# Altium schematic sheet FPGA_SDRAM.SchDoc
size A3; DocumentNumber: 18; SheetNumber: 18; SheetTotal: 30
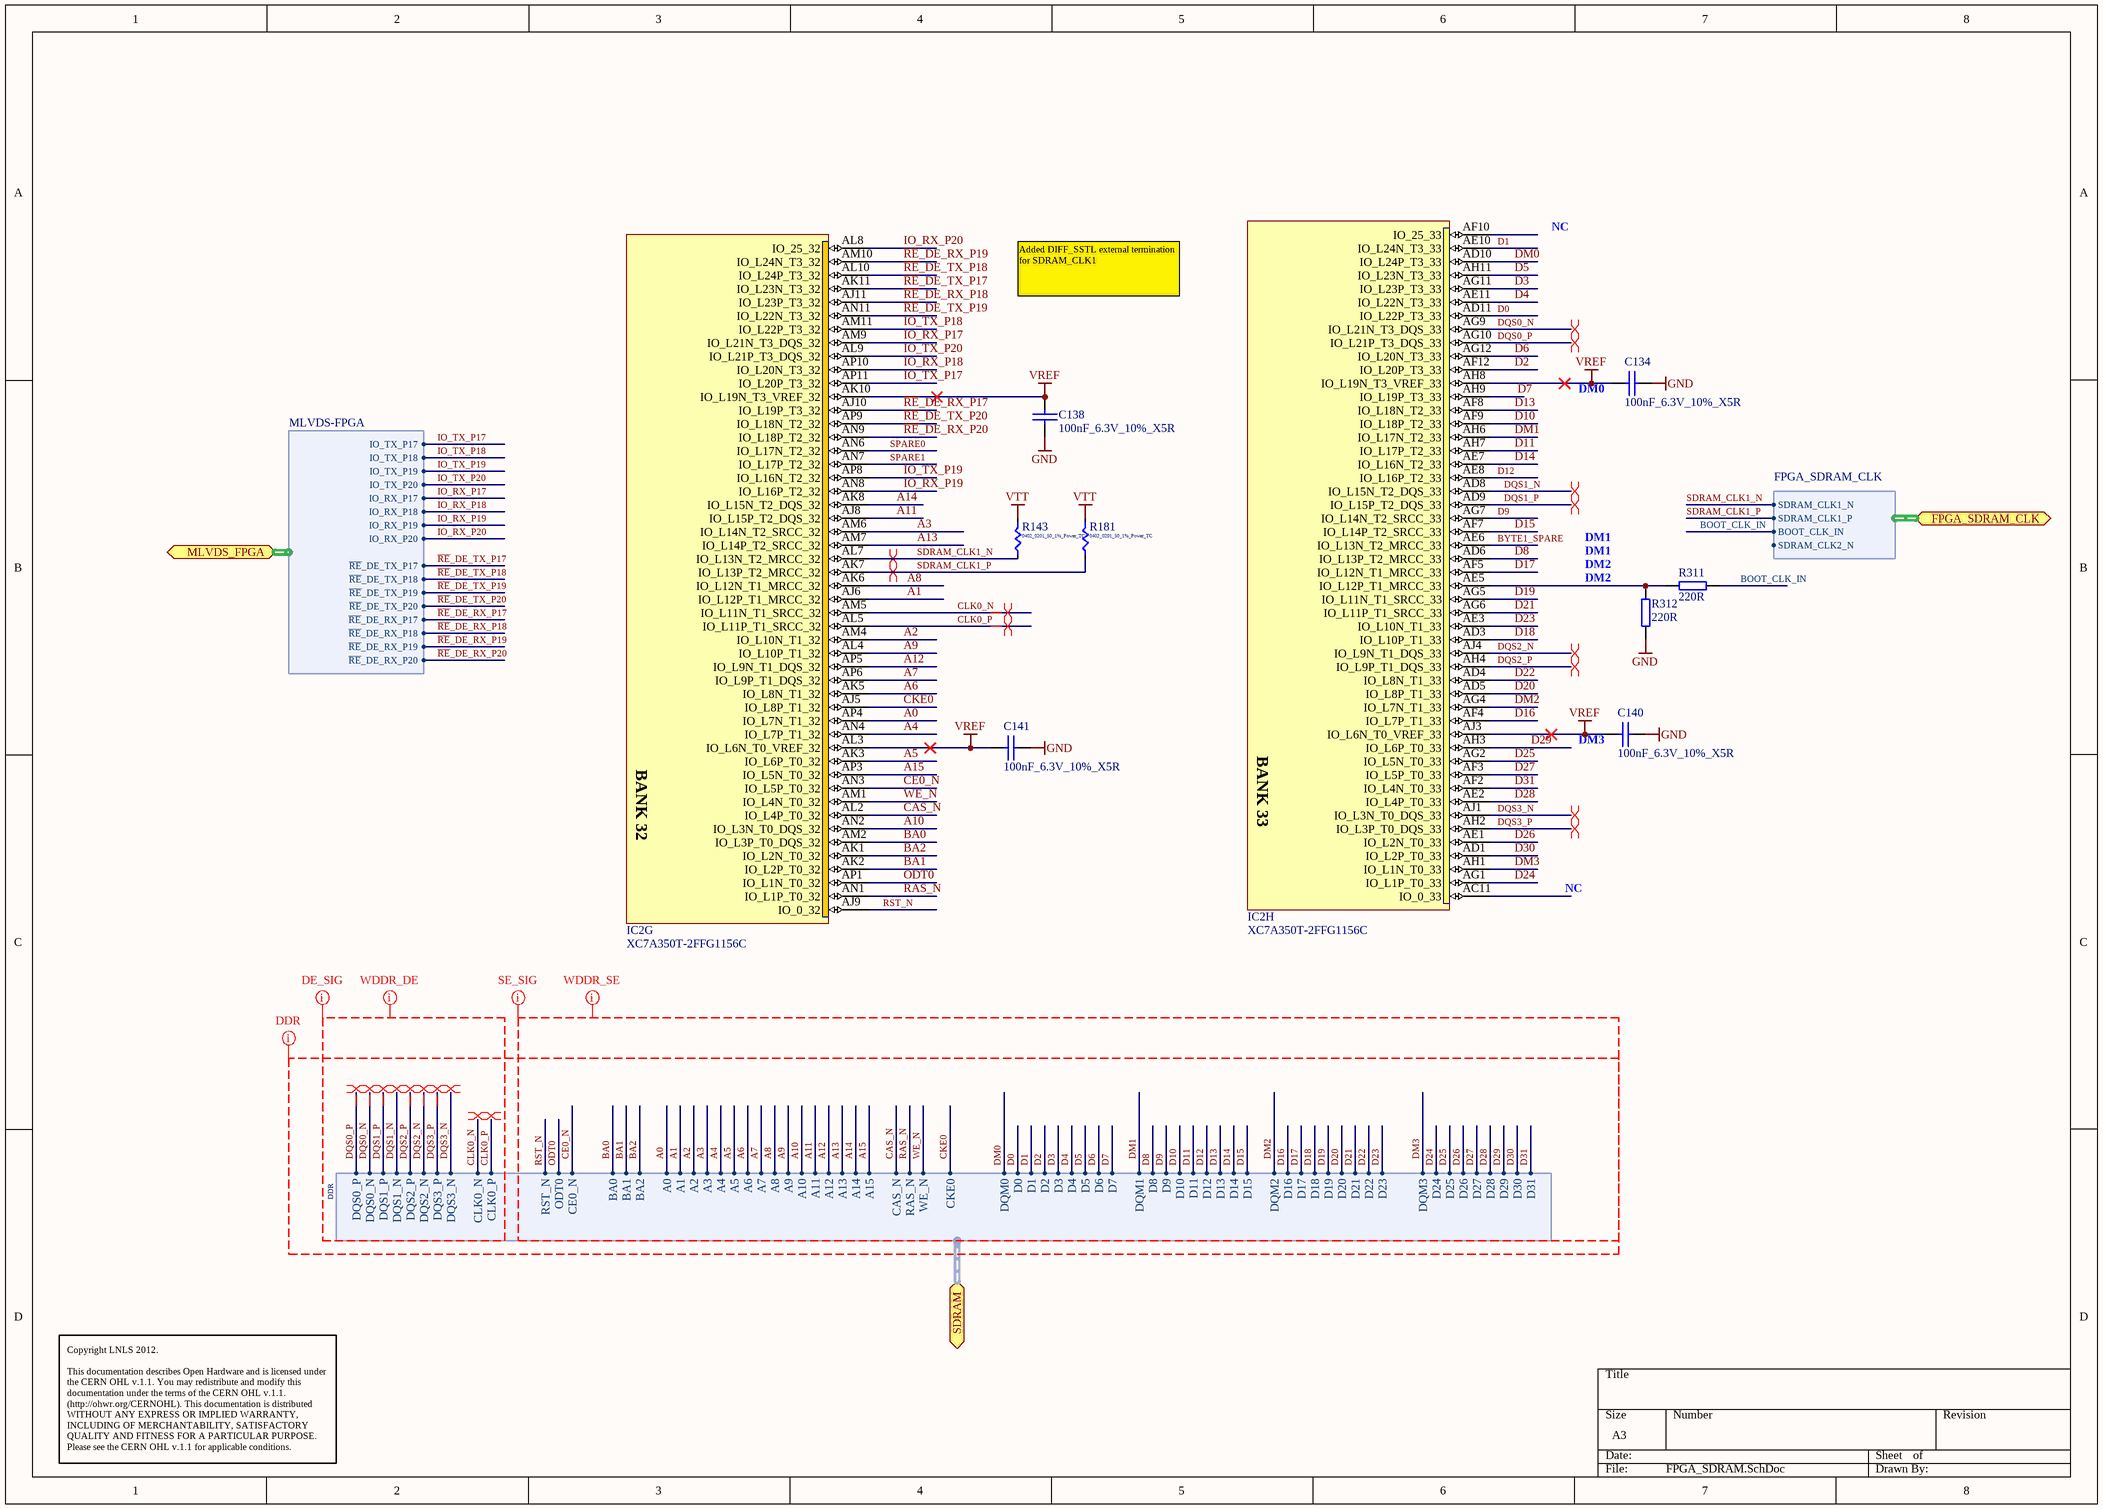
[diagram p0: FPGA_SDRAM.SchDoc]

## Parts
C134  100nF_6.3V_10%_X5R  [0201C]
C138  100nF_6.3V_10%_X5R  [0201C]
C140  100nF_6.3V_10%_X5R  [0201C]
C141  100nF_6.3V_10%_X5R  [0201C]
IC2  XC7A350T-2FFG1156C  [BGA1156C100P34X34_3500X3500X335]  (parts G,H of 23)
R143  0402_0201_50_1%_Power_TC  [RESC0603X40N]
R181  0402_0201_50_1%_Power_TC  [RESC0603X40N]
R311  220R  [0402R]
R312  220R  [0402R]

## Ports
FPGA_SDRAM_CLK (harness FPGA_SDRAM_CLK), MLVDS_FPGA (harness MLVDS-FPGA), SDRAM (harness DDR)

## Harnesses
DDR: CKE0, A0, A1, A2, A3, A4, A5, A7, A8, A9, A10, A11, A12, A13, BA0, BA1, BA2, A14, A15, CAS_N, RAS_N, WE_N, CE0_N, A6, D0, D1, D2, D3, D4, D5, D6, D7, D8, D9, D10, D11, D12, D13, D14, D15, CLK0_N, CLK0_P, ODT0, RST_N, D16, D17, D18, D19, D20, D21, D22, D23, D24, D25, D26, D27, D28, D29, D30, D31, DQS0_P, DQS1_P, DQS0_N, DQS1_N, DQS3_N, DQS3_P, DQS2_P, DQS2_N, DQM0, DQM1, DQM2, DQM3
MLVDS-FPGA: IO_TX_P17, IO_TX_P18, IO_TX_P19, IO_TX_P20, IO_RX_P17, IO_RX_P18, IO_RX_P19, IO_RX_P20, ~{RE}_DE_TX_P17, ~{RE}_DE_TX_P18, ~{RE}_DE_TX_P19, ~{RE}_DE_TX_P20, ~{RE}_DE_RX_P17, ~{RE}_DE_RX_P18, ~{RE}_DE_RX_P19, ~{RE}_DE_RX_P20
FPGA_SDRAM_CLK: SDRAM_CLK1_N, SDRAM_CLK1_P, BOOT_CLK_IN, SDRAM_CLK2_N

## Nets
GND: C134.2 C138.2 C140.2 C141.2 R312.1
VREF: C134.1 C138.1 C140.1 C141.1 IC2.AH8(IO_L19N_T3_VREF_33) IC2.AJ3(IO_L6N_T0_VREF_33) IC2.AK10(IO_L19N_T3_VREF_32) IC2.AL3(IO_L6N_T0_VREF_32)
VTT: R143.1(+) R181.1(+)
A0: IC2.AP4(IO_L7N_T1_32) ; port SDRAM.A0
A1: IC2.AJ6(IO_L12P_T1_MRCC_32) ; port SDRAM.A1
A2: IC2.AM4(IO_L10N_T1_32) ; port SDRAM.A2
A3: IC2.AM6(IO_L14N_T2_SRCC_32) ; port SDRAM.A3
A4: IC2.AN4(IO_L7P_T1_32) ; port SDRAM.A4
A5: IC2.AK3(IO_L6P_T0_32) ; port SDRAM.A5
A6: IC2.AK5(IO_L8N_T1_32) ; port SDRAM.A6
A7: IC2.AP6(IO_L9P_T1_DQS_32) ; port SDRAM.A7
A8: IC2.AK6(IO_L12N_T1_MRCC_32) ; port SDRAM.A8
A9: IC2.AL4(IO_L10P_T1_32) ; port SDRAM.A9
A10: IC2.AN2(IO_L3N_T0_DQS_32) ; port SDRAM.A10
A11: IC2.AJ8(IO_L15P_T2_DQS_32) ; port SDRAM.A11
A12: IC2.AP5(IO_L9N_T1_DQS_32) ; port SDRAM.A12
A13: IC2.AM7(IO_L14P_T2_SRCC_32) ; port SDRAM.A13
A14: IC2.AK8(IO_L15N_T2_DQS_32) ; port SDRAM.A14
A15: IC2.AP3(IO_L5N_T0_32) ; port SDRAM.A15
BA0: IC2.AM2(IO_L3P_T0_DQS_32) ; port SDRAM.BA0
BA1: IC2.AK2(IO_L2P_T0_32) ; port SDRAM.BA1
BA2: IC2.AK1(IO_L2N_T0_32) ; port SDRAM.BA2
BOOT_CLK_IN: R311.2 ; port FPGA_SDRAM_CLK.BOOT_CLK_IN
BYTE1_SPARE: IC2.AE6(IO_L13N_T2_MRCC_33)
CAS_N: IC2.AL2(IO_L4P_T0_32) ; port SDRAM.CAS_N
CE0_N: IC2.AN3(IO_L5P_T0_32) ; port SDRAM.CE0_N
CKE0: IC2.AJ5(IO_L8P_T1_32) ; port SDRAM.CKE0
CLK0_N: IC2.AM5(IO_L11N_T1_SRCC_32) ; port SDRAM.CLK0_N
CLK0_P: IC2.AL5(IO_L11P_T1_SRCC_32) ; port SDRAM.CLK0_P
D0: IC2.AD11(IO_L22P_T3_33) ; port SDRAM.D0
D1: IC2.AE10(IO_L24N_T3_33) ; port SDRAM.D1
D2: IC2.AF12(IO_L20P_T3_33) ; port SDRAM.D2
D3: IC2.AG11(IO_L23P_T3_33) ; port SDRAM.D3
D4: IC2.AE11(IO_L22N_T3_33) ; port SDRAM.D4
D5: IC2.AH11(IO_L23N_T3_33) ; port SDRAM.D5
D6: IC2.AG12(IO_L20N_T3_33) ; port SDRAM.D6
D7: IC2.AH9(IO_L19P_T3_33) ; port SDRAM.D7
D8: IC2.AD6(IO_L13P_T2_MRCC_33) ; port SDRAM.D8
D9: IC2.AG7(IO_L14N_T2_SRCC_33) ; port SDRAM.D9
D10: IC2.AF9(IO_L18P_T2_33) ; port SDRAM.D10
D11: IC2.AH7(IO_L17P_T2_33) ; port SDRAM.D11
D12: IC2.AE8(IO_L16P_T2_33) ; port SDRAM.D12
D13: IC2.AF8(IO_L18N_T2_33) ; port SDRAM.D13
D14: IC2.AE7(IO_L16N_T2_33) ; port SDRAM.D14
D15: IC2.AF7(IO_L14P_T2_SRCC_33) ; port SDRAM.D15
D16: IC2.AF4(IO_L7P_T1_33) ; port SDRAM.D16
D17: IC2.AF5(IO_L12N_T1_MRCC_33) ; port SDRAM.D17
D18: IC2.AD3(IO_L10P_T1_33) ; port SDRAM.D18
D19: IC2.AG5(IO_L11N_T1_SRCC_33) ; port SDRAM.D19
D20: IC2.AD5(IO_L8P_T1_33) ; port SDRAM.D20
D21: IC2.AG6(IO_L11P_T1_SRCC_33) ; port SDRAM.D21
D22: IC2.AD4(IO_L8N_T1_33) ; port SDRAM.D22
D23: IC2.AE3(IO_L10N_T1_33) ; port SDRAM.D23
D24: IC2.AG1(IO_L1P_T0_33) ; port SDRAM.D24
D25: IC2.AG2(IO_L5N_T0_33) ; port SDRAM.D25
D26: IC2.AE1(IO_L2N_T0_33) ; port SDRAM.D26
D27: IC2.AF3(IO_L5P_T0_33) ; port SDRAM.D27
D28: IC2.AE2(IO_L4P_T0_33) ; port SDRAM.D28
D29: IC2.AH3(IO_L6P_T0_33) ; port SDRAM.D29
D30: IC2.AD1(IO_L2P_T0_33) ; port SDRAM.D30
D31: IC2.AF2(IO_L4N_T0_33) ; port SDRAM.D31
DM0: IC2.AD10(IO_L24P_T3_33) ; port SDRAM.DQM0
DM1: IC2.AH6(IO_L17N_T2_33) ; port SDRAM.DQM1
DM2: IC2.AG4(IO_L7N_T1_33) ; port SDRAM.DQM2
DM3: IC2.AH1(IO_L1N_T0_33) ; port SDRAM.DQM3
DQS0_N: IC2.AG9(IO_L21N_T3_DQS_33) ; port SDRAM.DQS0_N
DQS0_P: IC2.AG10(IO_L21P_T3_DQS_33) ; port SDRAM.DQS0_P
DQS1_N: IC2.AD8(IO_L15N_T2_DQS_33) ; port SDRAM.DQS1_N
DQS1_P: IC2.AD9(IO_L15P_T2_DQS_33) ; port SDRAM.DQS1_P
DQS2_N: IC2.AJ4(IO_L9N_T1_DQS_33) ; port SDRAM.DQS2_N
DQS2_P: IC2.AH4(IO_L9P_T1_DQS_33) ; port SDRAM.DQS2_P
DQS3_N: IC2.AJ1(IO_L3N_T0_DQS_33) ; port SDRAM.DQS3_N
DQS3_P: IC2.AH2(IO_L3P_T0_DQS_33) ; port SDRAM.DQS3_P
IO_RX_P17: IC2.AM9(IO_L21N_T3_DQS_32) ; port MLVDS_FPGA.IO_RX_P17
IO_RX_P18: IC2.AP10(IO_L20N_T3_32) ; port MLVDS_FPGA.IO_RX_P18
IO_RX_P19: IC2.AN8(IO_L16P_T2_32) ; port MLVDS_FPGA.IO_RX_P19
IO_RX_P20: IC2.AL8(IO_25_32) ; port MLVDS_FPGA.IO_RX_P20
IO_TX_P17: IC2.AP11(IO_L20P_T3_32) ; port MLVDS_FPGA.IO_TX_P17
IO_TX_P18: IC2.AM11(IO_L22P_T3_32) ; port MLVDS_FPGA.IO_TX_P18
IO_TX_P19: IC2.AP8(IO_L16N_T2_32) ; port MLVDS_FPGA.IO_TX_P19
IO_TX_P20: IC2.AL9(IO_L21P_T3_DQS_32) ; port MLVDS_FPGA.IO_TX_P20
ODT0: IC2.AP1(IO_L1N_T0_32) ; port SDRAM.ODT0
~{RE}_DE_RX_P17: IC2.AJ10(IO_L19P_T3_32) ; port MLVDS_FPGA.~{RE}_DE_RX_P17
~{RE}_DE_RX_P18: IC2.AJ11(IO_L23P_T3_32) ; port MLVDS_FPGA.~{RE}_DE_RX_P18
~{RE}_DE_RX_P19: IC2.AM10(IO_L24N_T3_32) ; port MLVDS_FPGA.~{RE}_DE_RX_P19
~{RE}_DE_RX_P20: IC2.AN9(IO_L18P_T2_32) ; port MLVDS_FPGA.~{RE}_DE_RX_P20
~{RE}_DE_TX_P17: IC2.AK11(IO_L23N_T3_32) ; port MLVDS_FPGA.~{RE}_DE_TX_P17
~{RE}_DE_TX_P18: IC2.AL10(IO_L24P_T3_32) ; port MLVDS_FPGA.~{RE}_DE_TX_P18
~{RE}_DE_TX_P19: IC2.AN11(IO_L22N_T3_32) ; port MLVDS_FPGA.~{RE}_DE_TX_P19
~{RE}_DE_TX_P20: IC2.AP9(IO_L18N_T2_32) ; port MLVDS_FPGA.~{RE}_DE_TX_P20
RAS_N: IC2.AN1(IO_L1P_T0_32) ; port SDRAM.RAS_N
RST_N: IC2.AJ9(IO_0_32) ; port SDRAM.RST_N
SDRAM_CLK1_N: IC2.AL7(IO_L13N_T2_MRCC_32) R143.2(-) ; port FPGA_SDRAM_CLK.SDRAM_CLK1_N
SDRAM_CLK1_P: IC2.AK7(IO_L13P_T2_MRCC_32) R181.2(-) ; port FPGA_SDRAM_CLK.SDRAM_CLK1_P
SPARE0: IC2.AN6(IO_L17N_T2_32)
SPARE1: IC2.AN7(IO_L17P_T2_32)
WE_N: IC2.AM1(IO_L4N_T0_32) ; port SDRAM.WE_N
NetIC2_AE5: IC2.AE5(IO_L12P_T1_MRCC_33) R311.1 R312.2

Not connected (* = marked no-connect by the designer): IC2 AC11(IO_0_33) AF10(IO_25_33)

## Layout directives
differential pair: CLK0_N, CLK0_P, DQS0_N, DQS0_P, DQS1_N, DQS1_P, DQS2_N, DQS2_P, DQS3_N, DQS3_P, SDRAM_CLK1_N, SDRAM_CLK1_P
net class DDR: A0, A1, A2, A3, A4, A5, A6, A7, A8, A9, A10, A11, A12, A13, A14, A15, BA0, BA1, BA2, CAS_N, CE0_N, CKE0, CLK0_N, CLK0_P, D0, D1, D2, D3, D4, D5, D6, D7, D8, D9, D10, D11, D12, D13, D14, D15, D16, D17, D18, D19, D20, D21, D22, D23, D24, D25, D26, D27, D28, D29, D30, D31, DM0, DM1, DM2, DM3, DQS0_N, DQS0_P, DQS1_N, DQS1_P, DQS2_N, DQS2_P, DQS3_N, DQS3_P, ODT0, RAS_N, RST_N, WE_N
net class DE_SIG: CLK0_N, CLK0_P, DQS0_N, DQS0_P, DQS1_N, DQS1_P, DQS2_N, DQS2_P, DQS3_N, DQS3_P
net class SE_SIG: A0, A1, A2, A3, A4, A5, A6, A7, A8, A9, A10, A11, A12, A13, A14, A15, BA0, BA1, BA2, CAS_N, CE0_N, CKE0, D0, D1, D2, D3, D4, D5, D6, D7, D8, D9, D10, D11, D12, D13, D14, D15, D16, D17, D18, D19, D20, D21, D22, D23, D24, D25, D26, D27, D28, D29, D30, D31, DM0, DM1, DM2, DM3, ODT0, RAS_N, RST_N, WE_N
net class WDDR_DE: CLK0_N, CLK0_P, DQS0_N, DQS0_P, DQS1_N, DQS1_P, DQS2_N, DQS2_P, DQS3_N, DQS3_P
net class WDDR_SE: A0, A1, A2, A3, A4, A5, A6, A7, A8, A9, A10, A11, A12, A13, A14, A15, BA0, BA1, BA2, CAS_N, CE0_N, CKE0, D0, D1, D2, D3, D4, D5, D6, D7, D8, D9, D10, D11, D12, D13, D14, D15, D16, D17, D18, D19, D20, D21, D22, D23, D24, D25, D26, D27, D28, D29, D30, D31, DM0, DM1, DM2, DM3, ODT0, RAS_N, RST_N, WE_N

## Notes on the sheet
- NC
- Added DIFF_SSTL external termination for SDRAM_CLK1
- (near C134) DM0
- DM1
- (near R312) DM2
- DM2
- (near C140) DM3
- Copyright LNLS 2012.
  This documentation describes Open Hardware and is licensed under the CERN OHL v.1.1. You may redistribute and modify this documentation under the terms of the CERN OHL v.1.1. (http://ohwr.org/CERNOHL). This documentation is distributed WITHOUT ANY EXPRESS OR IMPLIED WARRANTY, INCLUDING OF MERCHANTABILITY, SATISFACTORY QUALITY AND FITNESS FOR A PARTICULAR PURPOSE. Please see the CERN OHL v.1.1 for applicable conditions.
- (in symbol XC7A350T-2FFG1156C, part G) BANK 32
- (in symbol XC7A350T-2FFG1156C, part H) BANK 33

## Library data of the parts
C134 C138 C140 C141 = CAP_SMD_0201: Capacitor SMD
IC2 = XC7A350T-2FFG1156C: Artix-6 FPGA, 16 GTPs, 600 User I/Os, 1156-Pin BGA, Speed Grade 2, Commercial Grade, Pb-Free; Part Description: Artix-7 FPGA, 16 GTPs, 600 User I/Os, 1156-Pin BGA, Speed Grade 2, Commercial Grade, Pb-Free; Manufacturer: XILINX; Table: Logic; Part Number: XC7A350T-2FFG1156C; Component Kind: Standard; Component Type: Standard; Device: XC7A350T-2FFG1156C; PackageDescription: BGA, 1.00mm Pitch, Square; 1156 Pin, 34 Columns X 34 Rows, 35.00mm X 35.00mm X 3.350mm H; Manufacturer Part Number: XC7A350T-2FFG1156C; Pin Count: 1156; Case: BGA1156; Mounted: Yes; Socket: No; SMD: Yes; ComponentHeight: 3.35mm; HelpURL: \\cern.ch\dfs\Applications\Altium\Datasheets\XC7A350T-2FFG1156C.pdf; ComponentLink1URL: \\cern.ch\dfs\Applications\Altium\Datasheets\XC7A350T-2FFG1156C.pdf; ComponentLink1Description: Package/Pinout; Author: CERN DEM JLC; CreateDate: 2012-09-19; LatestRevisionDate: 2012-09-19
R143 R181 = SMT_0402_0201: MiscInfo: Biggest Cern Footprint [max height]; Document Name: FPGA_SDRAM.SchDoc; Part Number: SMT_0402_0201; FootprintSizeX (mm): 1.8; FootprintSizeY (mm): 0.9; FootprintRectangleArea (mm): 1.62; Thickness (Max) (mm): 0.4; FootprintAlias: 0402
R311 R312 = RES_0402: SMD Resistor; Supplier 1: Newark; Supplier Part Number 1: 59M6691